# EAGLE design ASD2431 (EAGLE 6.3)
DATABASE: ./../../../../../Components/TinyCircuits_Part_Database.txt
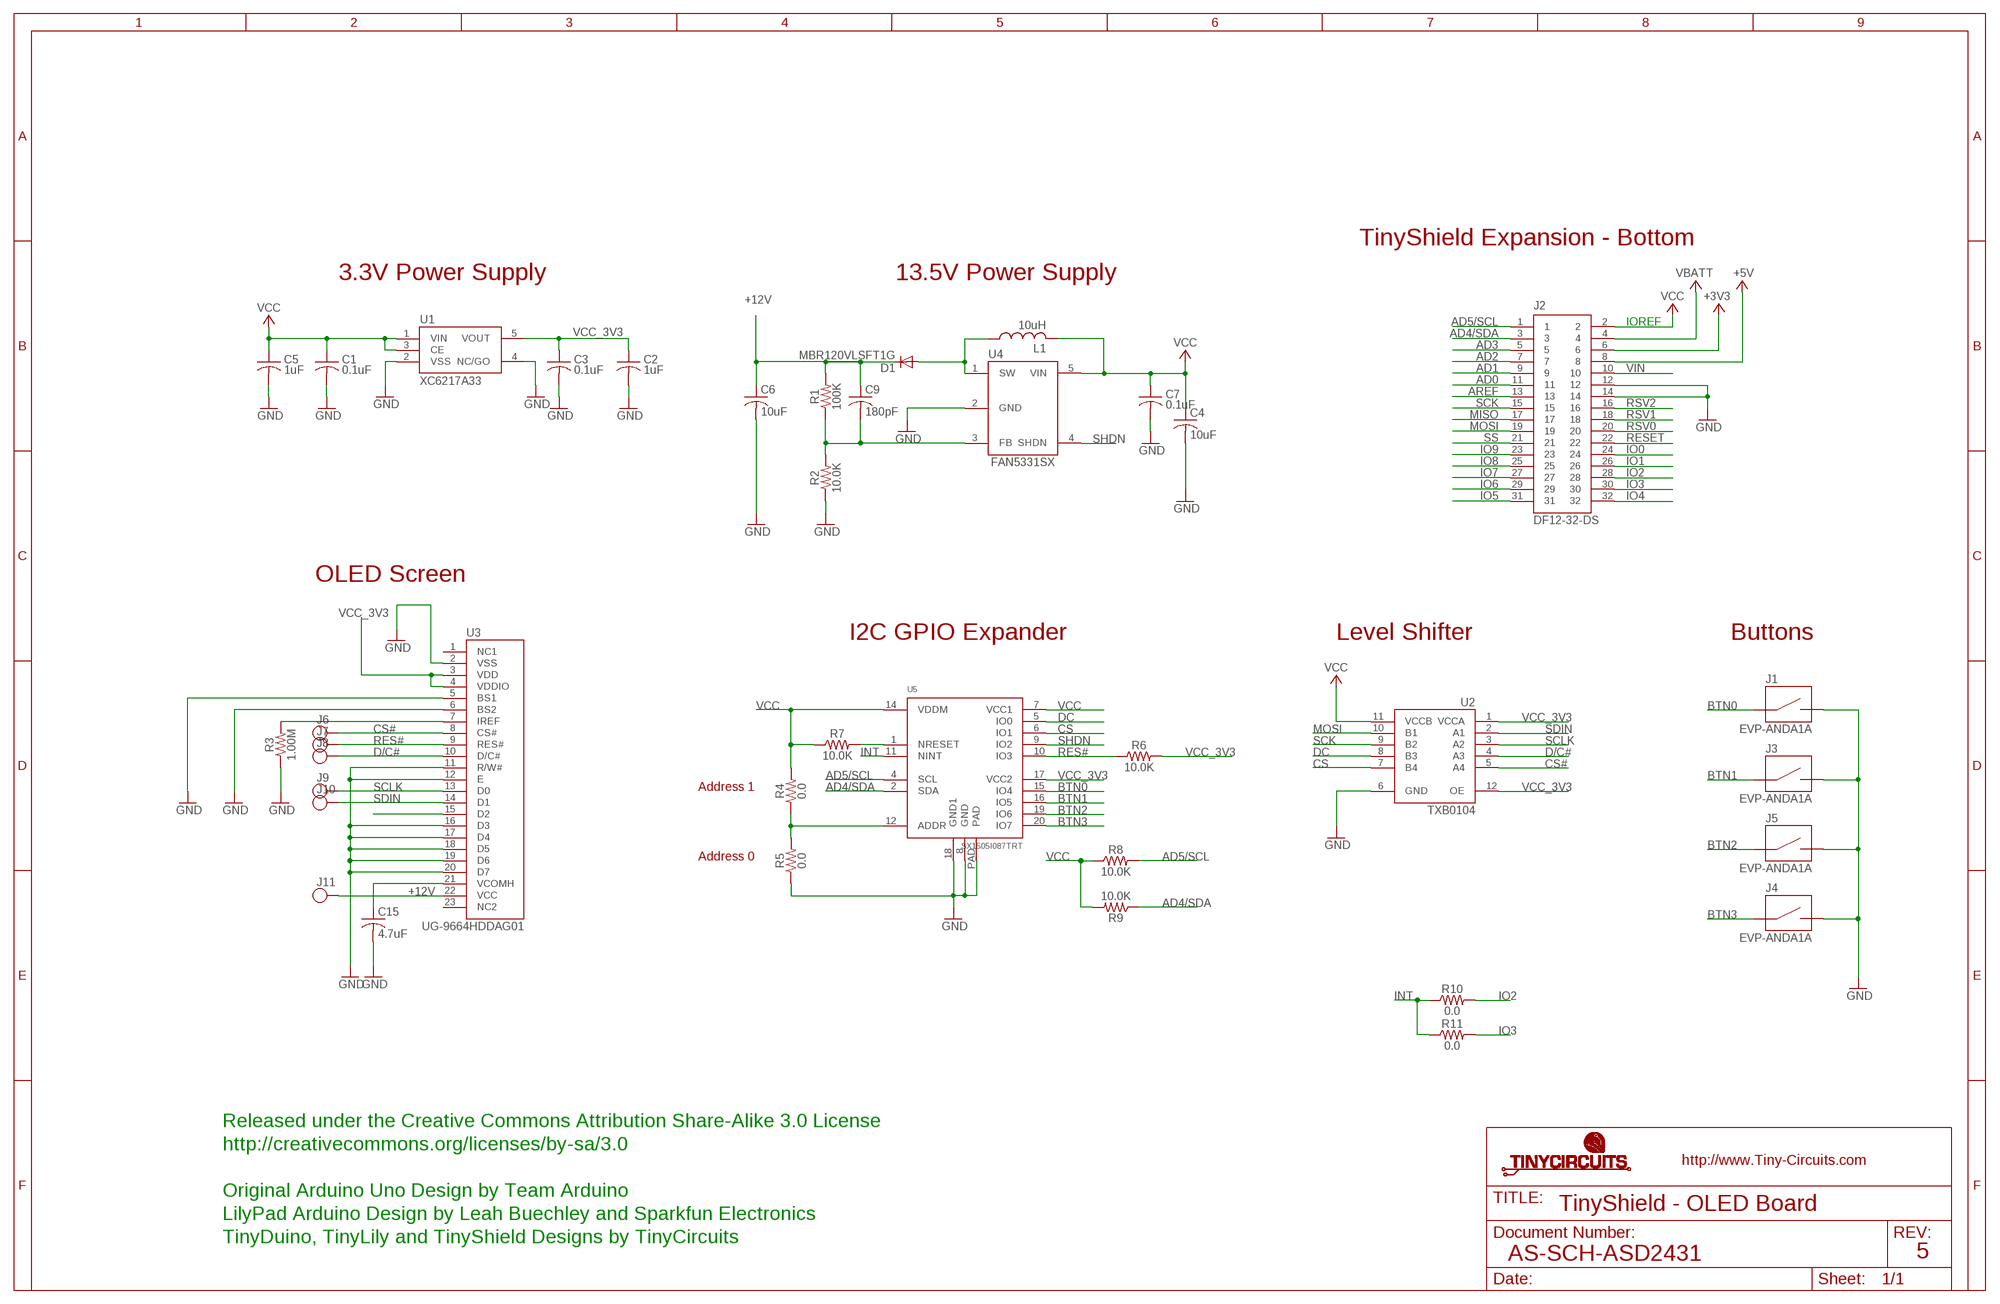
[diagram p0: schematic, sheet 1]

## Parts
C1  0.1uF  AS-ITM-00008  [C0402]
C2  1uF  AS-ITM-00105  [C0402]
C3  0.1uF  AS-ITM-00008  [C0402]
C4  10uF  AS-ITM-00045  [C0805]
C5  1uF  AS-ITM-00105  [C0402]
C6  10uF  AS-ITM-00045  [C0805]
C7  0.1uF  AS-ITM-00008  [C0402]
C9  180pF  AS-ITM-00243  [0402]
C15  4.7uF  AS-ITM-00232  [1206_CAP_TANT]
D1  MBR120VLSFT1G  AS-ITM-00111  [SOD-123FL]
J1  EVP-ANDA1A  AS-ITM-00236  [PTS840GKP]
J2  DF12-32-DS  AS-ITM-00012  [DF12-32-DS]
J3  EVP-ANDA1A  AS-ITM-00236  [PTS840GKP]
J4  EVP-ANDA1A  AS-ITM-00236  [PTS840GKP]
J5  EVP-ANDA1A  AS-ITM-00236  [PTS840GKP]
J6  TEST_POINT  [TEST_POINT_1MM]
J7  TEST_POINT  [TEST_POINT_1MM]
J8  TEST_POINT  [TEST_POINT_1MM]
J9  TEST_POINT  [TEST_POINT_1MM]
J10  TEST_POINT  [TEST_POINT_1MM]
J11  TEST_POINT  [TEST_POINT_1MM]
L1  10uH  AS-ITM-00165  [R0805]
R1  100K  AS-ITM-00004  [0402]
R2  10.0K  AS-ITM-00032  [0402]
R3  1.00M  AS-ITM-00005  [0402]
R4  0.0  AS-ITM-00076  [0402]
R5  0.0  AS-ITM-00076  [0402]
R6  10.0K  AS-ITM-00032  [0402]
R7  10.0K  AS-ITM-00032  [0402]
R8  10.0K  AS-ITM-00032  [0402]
R9  10.0K  AS-ITM-00032  [0402]
R10  0.0  AS-ITM-00076  [0402]
R11  0.0  AS-ITM-00076  [0402]
U1  XC6217A33  AS-ITM-00249  [SOT-25]
U2  TXB0104  AS-ITM-00048  [UQFN-12]
U3  UG-9664HDDAG01  AS-ITM-00158  [OLED_DISPLAY]
U4  FAN5331SX  AS-ITM-00163  [SOT-23]
U5  SX1505I087TRT  AS-ITM-00203  [QFN-UT20]

## Nets
+3V3: J2.6
+5V: J2.8
+12V: C6.1 C9.1 D1.C J11.P$1 R1.2 U3.22(VCC)
AD0: J2.11
AD1: J2.9
AD2: J2.7
AD3: J2.5
AD4/SDA: J2.3 R9.1 U5.2(SDA)
AD5/SCL: J2.1 R8.2 U5.4(SCL)
AREF: J2.13
BTN0: J1.1 J1.2 U5.15(IO4)
BTN1: J3.1 J3.2 U5.16(IO5)
BTN2: J5.1 J5.2 U5.19(IO6)
BTN3: J4.1 J4.2 U5.20(IO7)
CS: U2.7(B4) U5.6(IO1)
CS#: J6.P$1 U2.5(A4) U3.8(CS#)
D/C#: J8.P$1 U2.4(A3) U3.10(D/C#)
DC: U2.8(B3) U5.5(IO0)
GND: C1.2 C2.2 C3.2 C4.2 C5.2 C6.2 C7.2 C15.2 J1.3 J1.4 J2.12 J2.14 J3.3 J3.4 J4.3 J4.4 J5.3 J5.4 R2.1 R3.1 R5.1 U1.2(VSS) U1.4(NC/GO) U2.6(GND) U3.2(VSS) U3.5(BS1) U3.6(BS2) U3.11(R/W#) U3.12(E) U3.16(D3) U3.17(D4) U3.18(D5) U3.19(D6) U3.20(D7) U4.2(GND) U5.8(GND) U5.18(GND1) U5.PAD
INT: R10.1 R11.1 U5.11(NINT)
IO0: J2.24
IO1: J2.26
IO2: J2.28 R10.2
IO3: J2.30 R11.2
IO4: J2.32
IO5: J2.31
IO6: J2.29
IO7: J2.27
IO8: J2.25
IO9: J2.23
MISO: J2.17
MOSI: J2.19 U2.10(B1)
N$1: R7.2 U5.1(NRESET)
N$2: D1.A L1.1 U4.1(SW)
N$3: C9.2 R1.1 R2.2 U4.3(FB)
N$6: R3.2 U3.7(IREF)
N$7: C15.1 U3.21(VCOMH)
N$13: R4.1 R5.2 U5.12(ADDR)
N$15: U3.15(D2)
RES#: J7.P$1 R6.1 U3.9(RES#) U5.10(IO3)
RESET: J2.22
RSV0: J2.20
RSV1: J2.18
RSV2: J2.16
SCK: J2.15 U2.9(B2)
SCLK: J9.P$1 U2.3(A2) U3.13(D0)
SDIN: J10.P$1 U2.2(A1) U3.14(D1)
SHDN: U4.4(SHDN) U5.9(IO2)
SS: J2.21
VBATT: J2.4
VCC: C1.1 C4.1 C5.1 C7.1 J2.2 L1.2 R4.2 R7.1 R8.1 R9.2 U1.1(VIN) U1.3(CE) U2.11(VCCB) U4.5(VIN) U5.7(VCC1) U5.14(VDDM)
VCC_3V3: C2.1 C3.1 R6.2 U1.5(VOUT) U2.1(VCCA) U2.12(OE) U3.3(VDD) U3.4(VDDIO) U5.17(VCC2)
VIN: J2.10
Unconnected: U3.1(NC1) U3.23(NC2)

## Notes on the sheet
- TinyShield Expansion - Bottom
- 3.3V Power Supply | 13.5V Power Supply
- IOREF
- OLED Screen
- I2C GPIO Expander | Level Shifter | Buttons
- Address 1
- Address 0
- Released under the Creative Commons Attribution Share-Alike 3.0 License
- http://creativecommons.org/licenses/by-sa/3.0
- Original Arduino Uno Design by Team Arduino
- TinyShield - OLED Board
- LilyPad Arduino Design by Leah Buechley and Sparkfun Electronics
- TinyDuino, TinyLily and TinyShield Designs by TinyCircuits
- AS-SCH-ASD2431 | 5

## Library data of the parts
C1 C3 C7 = tinycircuits:AS-ITM-00008: CAP CER 0.1UF 16V 10% X5R 0402; PARTNO: AS-ITM-00008
C2 C5 = tinycircuits:AS-ITM-00105: CAP CER 1UF 6.3V 10% X5R 0402; PARTNO: AS-ITM-00105
C4 C6 = tinycircuits:AS-ITM-00045: CAP CER 16UF 16V 20% X5R 0805; PARTNO: AS-ITM-00045
C9 = tinycircuits:AS-ITM-00243: CAP CER 180PF 50V 5% NP0 0402; PARTNO: AS-ITM-00243
C15 = tinycircuits:AS-ITM-00232: CAP TANT 4.7UF 20V 20% 1206; PARTNO: AS-ITM-00232; VALUE: F931D475MAA
D1 = tinycircuits:AS-ITM-00111: DIODE SCHOTTKY 20V 1A SOD123L; PARTNO: AS-ITM-00111
J1 J3-J5 = tinycircuits:AS-ITM-00236: SWITCH TACTILE SPST-NO 0.05A 12V; PARTNO: AS-ITM-00236; VALUE: PTS840 GKP
J2 = tinycircuits:AS-ITM-00012: CONN RECEPT 32POS 3MM SMD 0.5MM; PARTNO: AS-ITM-00012
J6-J11 = tinycircuits:TEST_POINT: Test point, no drill
L1 = tinycircuits:AS-ITM-00165: INDUCTOR MULTILAYER 10UH 0805; PARTNO: AS-ITM-00165
R1 = tinycircuits:AS-ITM-00004: RES 100K OHM 1/16W 1% 0402; PARTNO: AS-ITM-00004
R2 R6-R9 = tinycircuits:AS-ITM-00032: RES 10.0K OHM 1/16W 1% 0402 SMD; PARTNO: AS-ITM-00032
R3 = tinycircuits:AS-ITM-00005: RES 1.00M OHM 1/16W 1% 0402; PARTNO: AS-ITM-00005
R4 R5 R10 R11 = tinycircuits:AS-ITM-00076: RES 0.0 OHM 1/16W 1% 0402 SMD; PARTNO: AS-ITM-00076
U1 = tinycircuits:AS-ITM-00249: IC REG LDO 3.3V 0.2A SOT25; PARTNO: AS-ITM-00249
U2 = tinycircuits:AS-ITM-00048: IC VOLT-LEVEL TRANSLATOR 12UQFN; PARTNO: AS-ITM-00048
U3 = tinycircuits:AS-ITM-00158: 0.96" OLED Display; PARTNO: AS-ITM-00158
U4 = tinycircuits:AS-ITM-00163: IC LED DRVR WHITE BCKLGT SOT23-5; PARTNO: AS-ITM-00163
U5 = tinycircuits:AS-ITM-00203: IC GPIO EXP I2C 8CH 20UTQFN; PARTNO: AS-ITM-00203

## Board
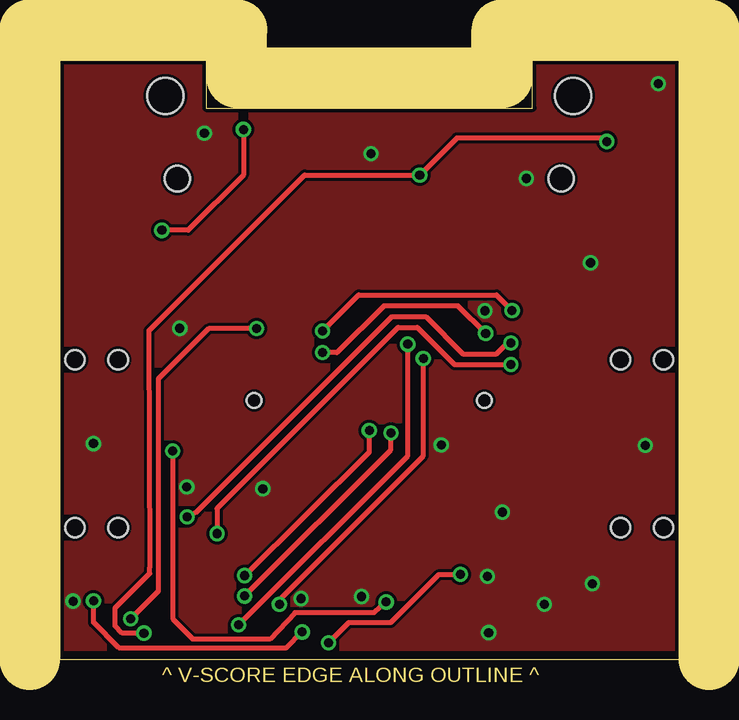
[diagram p1: board, top side]
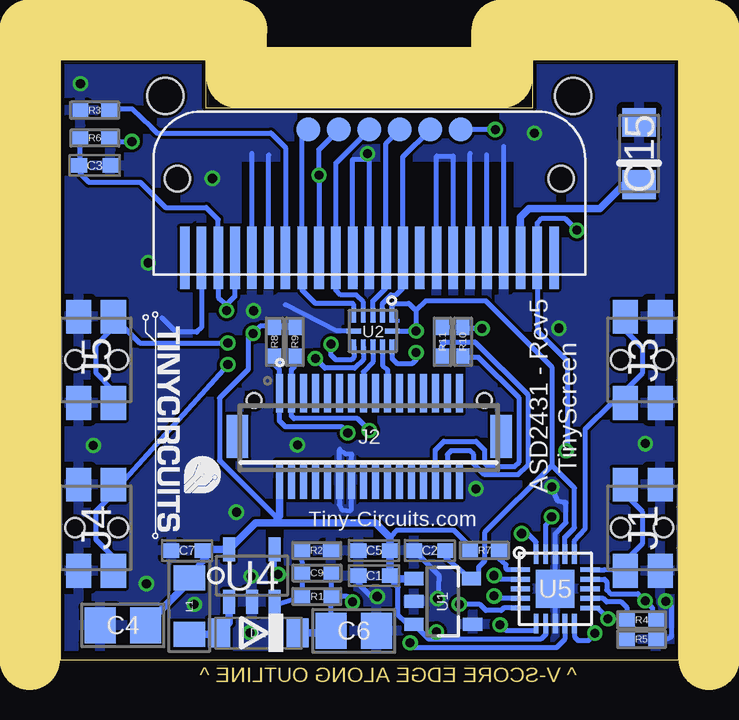
[diagram p2: board, bottom side, seen from below]

Size 25.8 x 25 mm. Coordinates in mm from the lower left corner, seen from the top.
Outline: 0,25 6.1,25 6.1,23 19.7,23 19.7,25 25.8,25 25.8,0 0,0 0,25
Copper layers (1*16): Top 0.035mm / dielectric 1.5mm / Bottom 0.035mm
Design rules "default *": minimum track width 5mil, minimum drill 12mil, track to track 5mil, track to pad 5mil, pad to pad 5mil, via to via 6mil, smd to smd 5mil, copper to edge 6mil, drill to drill 8mil, minimum pad ring 10mil, minimum via ring 5mil, stop-mask expansion 4mil, vias tented up to drill 25mil, thermal gap 10mil
Holes 1.5 mm at 4.4,23.5 21.4,23.5
tRestrict: 1 lines
bRestrict: area 19.6,13.5 to 20.2,18.2; area 6.9,15.5 to 14,20.8; area 16.8,15.4 to 18.2,20.8; 2 lines
Milling: 7 lines

### Footprints (pad centres in the part's own frame; a part is rotated, then mirrored left to right if it is on the bottom)
C0402 = smd 0.65 x 0.6: 1 -0.65,0; 2 0.65,0
C0805 = smd 1.3 x 1.5: 1 -0.95,0; 2 0.95,0
0402 = smd 0.65 x 0.55: 1 -0.6,0; 2 0.6,0
1206_CAP_TANT = smd 1.2 x 1.4: 1 -1.3,0; 2 1.3,0
SOD-123FL = smd 0.914 x 1.219: A 1.638,0; C -1.638,0
PTS840GKP = smd 1.4 x 1.05: 1 -1.8,0.725; 2 1.8,0.725; 3 -1.8,-0.725; 4 1.8,-0.725 | hole 0.8: 0,0.925; 0,-0.875
DF12-32-DS = smd 0.3 x 1.6: 1 -3.75,1.8; 2 -3.75,-1.8; 3 -3.25,1.8; 4 -3.25,-1.8; 5 -2.75,1.8; 6 -2.75,-1.8; 7 -2.25,1.8; 8 -2.25,-1.8; 9 -1.75,1.8; 10 -1.75,-1.8; 11 -1.25,1.8; 12 -1.25,-1.8; 13 -0.75,1.8; 14 -0.75,-1.8; 15 -0.25,1.8; 16 -0.25,-1.8; 17 0.25,1.8; 18 0.25,-1.8; 19 0.75,1.8; 20 0.75,-1.8; 21 1.25,1.8; 22 1.25,-1.8; 23 1.75,1.8; 24 1.75,-1.8; 25 2.25,1.8; 26 2.25,-1.8; 27 2.75,1.8; 28 2.75,-1.8; 29 3.25,1.8; 30 3.25,-1.8; 31 3.75,1.8; 32 3.75,-1.8 | smd 0.9 x 1.8: F1 -5.5,0; F2 5.5,0 | hole 0.6: -4.8,1.5; 4.8,1.5
TEST_POINT_1MM = smd 1 x 1: P$1 0,0
R0805 = smd 1.05 x 1.3: 1 -1.175,0; 2 1.175,0
SOT-25 = smd 0.55 x 0.8: 1 -0.95,-1.2; 2 0,-1.2; 3 0.95,-1.2; 4 0.95,1.25; 5 -0.95,1.2
UQFN-12 = smd 0.2 x 0.6: 1 -0.8,-0.65; 2 -0.4,-0.65; 3 0,-0.65; 4 0.4,-0.65; 5 0.8,-0.65; 7 0.8,0.65; 8 0.4,0.65; 9 0,0.65; 10 -0.4,0.65; 11 -0.8,0.65 | smd 0.6 x 0.2: 6 0.8,0; 12 -0.8,0
OLED_DISPLAY = smd 0.4 x 2.6: 1 -7.7,0.2; 2 -7,0.2; 3 -6.3,0.2; 4 -5.6,0.2; 5 -4.9,0.2; 6 -4.2,0.2; 7 -3.5,0.2; 8 -2.8,0.2; 9 -2.1,0.2; 10 -1.4,0.2; 11 -0.7,0.2; 12 0,0.2; 13 0.7,0.2; 14 1.4,0.2; 15 2.1,0.2; 16 2.8,0.2; 17 3.5,0.2; 18 4.2,0.2; 19 4.9,0.2; 20 5.6,0.2; 21 6.3,0.2; 22 7,0.2; 23 7.7,0.2 | hole 1.05: 8,3.5; -8,3.5
SOT-23 = smd 0.5 x 1: 1 -0.95,-1.1; 2 0,-1.1; 3 0.95,-1.1; 4 0.95,1.1; 5 -0.95,1.1
QFN-UT20 = smd 0.8 x 0.2: 1 -1.45,0.8; 2 -1.45,0.4; 3 -1.45,0; 4 -1.45,-0.4; 5 -1.45,-0.8; 11 1.45,-0.8; 12 1.45,-0.4; 13 1.45,0; 14 1.45,0.4; 15 1.45,0.8 | smd 0.2 x 0.8: 6 -0.8,-1.45; 7 -0.4,-1.45; 8 0,-1.45; 9 0.4,-1.45; 10 0.8,-1.45; 16 0.8,1.45; 17 0.4,1.45; 18 0,1.45; 19 -0.4,1.45; 20 -0.8,1.45 | smd 1.6 x 1.6: PAD 0,0

### Placement (x,y rotation side)
C1  12.7,3.5 180 bottom
C2  10.38,4.55 180 bottom
C3  24.35,20.6 0 bottom
C4  23.18,1.43 180 bottom
C5  12.7,4.55 180 bottom
C6  13.55,1.2 0 bottom
C7  20.5,4.55 180 bottom
C9  15.09,3.61 180 bottom
C15  1.65,21.1 90 bottom
D1  17.53,1.11 180 bottom
J1  1.5,5.5 90 bottom
J2  12.9,9.3 0 bottom
J3  1.5,12.5 90 bottom
J4  24.3,5.5 270 bottom
J5  24.3,12.5 270 bottom
J6  15.44,22.1 0 bottom
J7  14.17,22.1 270 bottom
J8  12.9,22.1 270 bottom
J9  11.63,22.1 270 bottom
J10  10.36,22.1 270 bottom
J11  9.09,22.1 0 bottom
L1  20.41,2.23 90 bottom
R1  15.09,2.63 0 bottom
R2  15.1,4.55 180 bottom
R3  24.35,22.9 0 bottom
R4  1.55,1.65 0 bottom
R5  1.55,0.85 180 bottom
R6  24.35,21.75 180 bottom
R7  8.1,4.55 0 bottom
R8  16.85,13.25 270 bottom
R9  16,13.25 90 bottom
R10  9,13.25 270 bottom
R11  9.85,13.25 270 bottom
U1  9.84,2.42 270 bottom
U2  12.75,13.7 180 bottom
U3  12.9,16.55 0 bottom
U4  17.8,3.5 0 bottom
U5  5.15,2.95 0 bottom
U$1  [DOCFIELD-TINYCIRCUITS-PCB]  36.81,-5 0 top  (outside the outline)

### Tracks (layer width: path | path; a pad name or v marks a point on that pad's centre or on a via)
+12V  (via drill 0.38)
  Top 0.203: v13.6,2.4 13.1,1.95 9.8,1.95 8.75,0.85 5.55,0.85 4.7,1.7 v4.7,8.7 | 4.3,17.9 v4.25,17.9 5.35,17.9 7.65,20.2 v7.65,22.1
  Bottom 0.203: C9.1 R1.2 | C6.1 14.5,2.62 R1.2 | v13.6,2.4 13.83,2.63 R1.2 | v4.7,8.7 4.65,8.75 4.65,12.45 5.9,13.7 U3.22 5.9,18.2 5.7,18.4 4.75,18.4 v4.25,17.9 | v7.65,22.1 J11.P$1
  Bottom 0.305: D1.C 14.59,1.11 C6.1
AD4/SDA  (via drill 0.38)
  Top 0.203: v7.7,3.5 12.9,8.65 v12.9,9.55
  Bottom 0.203: U5.2 7.55,3.35 v7.7,3.5 | v12.9,9.55 13.4,10.05 16.05,10.05 16.15,10.15 J2.3 16.15,12.1 16,12.25 R9.1
AD5/SCL  (via drill 0.38)
  Top 0.203: v7.7,2.65 13.8,8.75 v13.8,9.45
  Bottom 0.203: U5.4 7.6,2.55 v7.7,2.65 | v13.8,9.45 14.05,9.7 16.4,9.7 16.65,9.95 J2.1 16.65,12.1 16.85,12.3 R8.2
BTN0
  Bottom 0.203: J1.1 2.33,3.76 | U5.15 3.08,3.75 2.33,3.76 | 2.33,3.76 2.64,3.71 1.5,4.85 1.5,6.15 2,6.65 2,7.07 J1.2
BTN1
  Bottom 0.203: J3.1 2.8,10.71 | U5.16 4.35,4.95 3.9,5.45 3.9,9.61 2.8,10.71 | 2.8,10.71 2.74,10.71 1.5,11.95 1.5,13 2.22,13.73 J3.2
BTN2  (via drill 0.38)
  Top 0.203: v5.3,5.95 5.7,6.15 13.85,14.3 15.25,14.3 16.8,12.75 18.2,12.75 18.65,13.2 v18.8,13.2
  Bottom 0.203: U5.19 5.55,5.6 v5.3,5.95 | J5.2 23.58,11.23 24.3,11.95 24.3,13.1 23.7,13.7 23.7,14.18 J5.1 22.48,13.2 v18.8,13.2
BTN3  (via drill 0.38)
  Top 0.203: v6.55,5.25 6.55,6.3 14.1,13.85 14.9,13.85 16.45,12.3 v18.8,12.3
  Bottom 0.203: U5.20 5.95,4.9 6.3,5.25 v6.55,5.25 | J4.2 23.58,4.28 24.3,5 24.3,6.2 23.75,6.75 23.75,7.12 J4.1 23.3,7.3 v18.8,12.3
CS  (via drill 0.38)
  Top 0.203: v14.5,13.15 14.5,8.5 v7.45,1.45
  Bottom 0.203: U2.7 13.55,12.6 13.65,12.5 14.3,12.5 14.5,12.7 v14.5,13.15 | U5.6 5.95,1.2 7.2,1.2 v7.45,1.45
CS#
  Bottom 0.203: U2.5 13.55,14.8 13.6,14.85 15.15,14.85 15.7,15.4 U3.8 15.7,21.79 J6.P$1
D/C#
  Bottom 0.203: U2.4 13.15,14.9 13.45,15.2 14.1,15.2 14.3,15.4 U3.10 14.3,20.7 J8.P$1
DC  (via drill 0.38)
  Top 0.203: v9.15,2.3 9.15,2.5 15.15,8.5 v15.15,12.55
  Bottom 0.203: U2.8 13.15,12.5 13.5,12.15 14.75,12.15 v15.15,12.55 | U5.5 7.3,2.15 7.4,2.05 8.05,2.05 8.3,2.3 v9.15,2.3
GND  (via drill 0.38)
  Bottom 0.203: 14.13,7.52 14.13,8.77 14.13,8.72 13.88,8.57 13.63,8.56 13.68,8.11 | 14.13,7.52 J2.12 14.15,6.45 14.05,6.25 13.7,6.2 13.65,6.25 J2.14 | 14.13,7.52 14.13,7.5 | U2.6 14.25,13.7 16.4,14.8 | v5.29,7.2 5.04,6.6 4.8,6.55 4.7,6.55 4.7,5.7 5.15,5.25 U5.18 U5.PAD U5.8 | R5.1 0.5,0.85 0.3,0.95 0.3,2.2 v0.55,2.43 | v12.57,2.63 12.59,2.65 12.85,2.65 13.35,3.15 C1.2 | C2.2 10,3.52 v10.05,2.54 | U3.2 19.9,13.85 20.1,13.65 20.95,13.65 21.55,14.25 | U3.20 7.3,21.4 | U3.19 8,21.05 | U3.18 8.7,21.1 | U3.17 9.4,21 10.1,21 U3.16 | U3.12 12.9,20.85 | U3.11 13.6,20.85 12.9,20.85 | U3.6 17.1,21.05 | U3.5 17.8,21.1 | 12.9,20.85 12.9,21.02 v12.97,21.09
  other vias: 18.44,6.14 20.2,2.3 15.9,8.94 17.83,3.47 22.12,16.54 24.41,8.92 8.46,7.12 1.4,9 5,13.81 22.2,3.16 19.45,20.06 6.02,21.94 17.88,1.12 17.72,14.54 24.95,24.01
  pour Bottom: 0,25 5.9,25 5.9,23 19.9,23 19.9,25 25.8,25 25.8,0 0,0
  pour Top: 0,25 6.1,25 6.1,23 19.7,23 19.7,25 25.8,25 25.8,0 0,0
INT  (via drill 0.38)
  Top 0.203: v8.2,13.8 6.2,13.8 4.1,11.7 4.1,2.85 v2.95,1.7
  Bottom 0.203: U5.11 3.4,2.15 v2.95,1.7 | v8.2,13.8 8.95,13.8 R10.1 R11.1
IO2
  Bottom 0.203: J2.28 10.15,8.75 9.8,9.1 8.45,9.1 8.1,8.75 8.1,8.2 7.95,8.05 6.85,8.05 6.65,8.25 6.65,10.9 8.35,12.6 8.95,12.6 R10.2
IO3
  Bottom 0.203: R11.2 9.85,13.2 9.8,13.25 8.5,13.25 6.3,11.05 6.3,8.1 6.7,7.7 8.1,7.7 8.55,8.15 8.55,8.55 8.7,8.7 9.5,8.7 9.65,8.55 J2.30
MOSI
  Bottom 0.203: U2.10 12.35,12.25 12.15,12.1 J2.19
N$1
  Bottom 0.203: U5.1 7.15,3.75 7.2,3.8 7.2,3.95 7.5,4.2 R7.2
N$2
  Bottom 0.305: L1.1 19.23,1.05 D1.A 18.75,1.54 U4.1
N$3
  Bottom 0.203: U4.3 16.83,2.28 R1.1 C9.2 R2.2
N$6
  Bottom 0.203: R3.2 23.45,22.95 22.8,22.95 22,22.2 21.75,21.95 17,21.95 16.4,21.35 U3.7
N$7
  Bottom 0.305: U3.21 6.6,18.45 6.25,18.8 3.3,18.8 2.3,19.8 C15.1
N$13
  Bottom 0.203: R5.2 R4.1 2.15,2.15 2.4,2.4 3,2.4 3.15,2.55 U5.12
RES#  (via drill 0.38)
  Top 0.203: v22.8,21.6 22.7,21.75 16.55,21.75 v15,20.2 10.2,20.2 3.7,13.7 3.74,3.85 3.74,3.59 2.3,2.15 2.3,1.4 2.6,1.1 v3.5,1.1
  Bottom 0.203: U3.9 v15,20.2 15,21.27 J7.P$1 | v22.8,21.6 23.6,21.6 R6.1 | U5.10 4.35,0.95 4.2,0.8 3.75,0.8 v3.5,1.1
SCK
  Bottom 0.203: U2.9 12.75,12.4 13.15,12 J2.15
SCLK
  Bottom 0.203: U2.3 12.75,14.95 12.2,15.5 U3.13 12.2,21.53 J9.P$1
SDIN
  Bottom 0.203: U2.2 12.35,14.85 12,15.2 11.8,15.2 11.5,15.5 U3.14 11.5,20.96 J10.P$1
SHDN  (via drill 0.38)
  Top 0.203: v11.2,0.7 12.05,1.55 13.8,1.55 15.8,3.55 v16.7,3.55
  Bottom 0.203: 16.85,4.95 U4.4 16.85,3.7 v16.7,3.55 | U5.9 4.75,0.85 5.1,0.5 11,0.5 v11.2,0.7
VCC  (via drill 0.38)
  Top 0.203: v10.1,1.15 9.45,0.5 2.45,0.5 1.4,1.55 v1.4,2.45 | v17.75,13.6 16.6,14.75 13.5,14.75 11.55,12.8 v10.95,12.8
  Bottom 0.203: U1.3 11.06,1.55 | U1.1 11,3.43 | U1.3 11.37,1.52 11.7,1.85 11.7,3.01 12.09,3.42 11.99,3.42 C1.1 | U2.11 11.95,12.55 11.75,12.35 11.1,12.35 10.95,12.5 v10.95,12.8 | U5.7 5.55,1.05 5.75,0.85 9.8,0.85 | 9.8,0.85 10.42,0.85 U1.3 | U5.14 3.1,3.35 3,3.25 3,2.9 2.85,2.75 1.7,2.75 v1.4,2.45 1.1,2.15 R4.2 | v10.1,1.15 9.8,0.85 | R7.1 8.65,4.65 9.4,5.4 11.75,5.4 12.05,5.1 | R9.2 R8.1 | 16.75,5.9 19.15,8.3 19.15,10.9 17.95,12.1 17.95,13.4 v17.75,13.6 17.45,13.9 16.05,13.9
  Bottom 0.254: R9.2 16.05,13.9
  Bottom 0.305: J2.2 16.65,6 16.75,5.9 16.75,5.7 | 16.75,5.7 17.65,5.7 U4.5 19.46,4.6 | 19.46,4.6 L1.2 20.46,3.2 C4.1 | 19.46,4.6 C7.1 | 16.75,5.7 12.65,5.7 12.05,5.1 C5.1 C1.1 11.92,3.37 U1.1
VCC_3V3  (via drill 0.38)
  Top 0.203: v10.95,13.7 12.45,15.2 18.2,15.2 v18.85,14.55
  Bottom 0.203: 18.85,14.8 19.2,15.1 U3.3 19.2,18.35 19.7,18.85 21.4,18.85 22.45,19.9 24.6,19.9 24.93,20.23 C3.1 24.95,20.65 R6.2 | U3.4 18.5,15.15 18.85,14.8 | 8.65,3.42 U1.5 | U2.1 11.95,14.75 11.85,14.85 11.25,14.85 10.95,14.55 | U2.12 v10.95,13.7 10.95,14.55 | U1.5 8.61,3.4 | 5.3,8.1 5.3,12.2 8.05,14.95 10.55,14.95 10.95,14.55 | 18.85,14.8 v18.85,14.55 | U5.17 4.75,5.1 4.35,5.5 4.35,7.15 5.3,8.1 | U1.5 8.35,3.48 8.35,3.85 8.1,4.1 8.1,5.3 5.3,8.1 | C2.1 9.73,4.26 U1.5

### Text on the board
Dimension: ^ V-SCORE EDGE ALONG OUTLINE ^
bPlace: ASD2431 - Rev5 | TinyScreen | Tiny-Circuits.com
Document: FABRICATION DRAWING | NOTES: | 1. PRINTED CIRCUIT BOARD MADE FROM NEMA GRADE FR-4 EPOXY LAMINATE | WITH 1 OUNCE COPPER PLATING AND .024 THICKNESS. | 2. ALL DIMENSIONS ARE GIVEN IN INCHES. | 3. CIRCUIT PATHS ARE FOR REFERENCE ONLY. | 4. HOLE SIZES SHOWN ARE FINISHED DIAMETERS AFTER PLATING. | 5. BOARD PLATED USING REFLOW OR SIMILAR METHOD. | 6. BOARD TO HAVE BLUE SOLDER MASK ON PLATED SURFACES USING WET FILM | 7. SILKSCREEN BOARD USING WHITE INK. | SR100 OR SR1010 EPOXY. EQUIVALENT WET OR DRY FILM MAY BE USED. | 8. THE FOLLOWING INFORMATION APPLIES TO THIS BOARD: | * 2 COPPER LAYERS | * .024 BOARD THICKNESS | * REQUIRES TOP SIDE SILKSCREEN | Released under the Creative Commons Attribution Share-Alike 3.0 License | http://creativecommons.org/licenses/by-sa/3.0 | Original Arduino Uno Design by Team Arduino | LilyPad Arduino Design by Leah Buechley and Sparkfun Electronics | TinyDuino, TinyLily and TinyShield Designs by TinyCircuits | TinyShield - OLED Board | AS-PCB-ASD2431 | 5